# Altium schematic sheet PRUC-Voltmeter_FPGA-Interface.SchDoc: Voltmeter / FPGA XADC
size A4; SheetNumber: 3; SheetTotal: 9
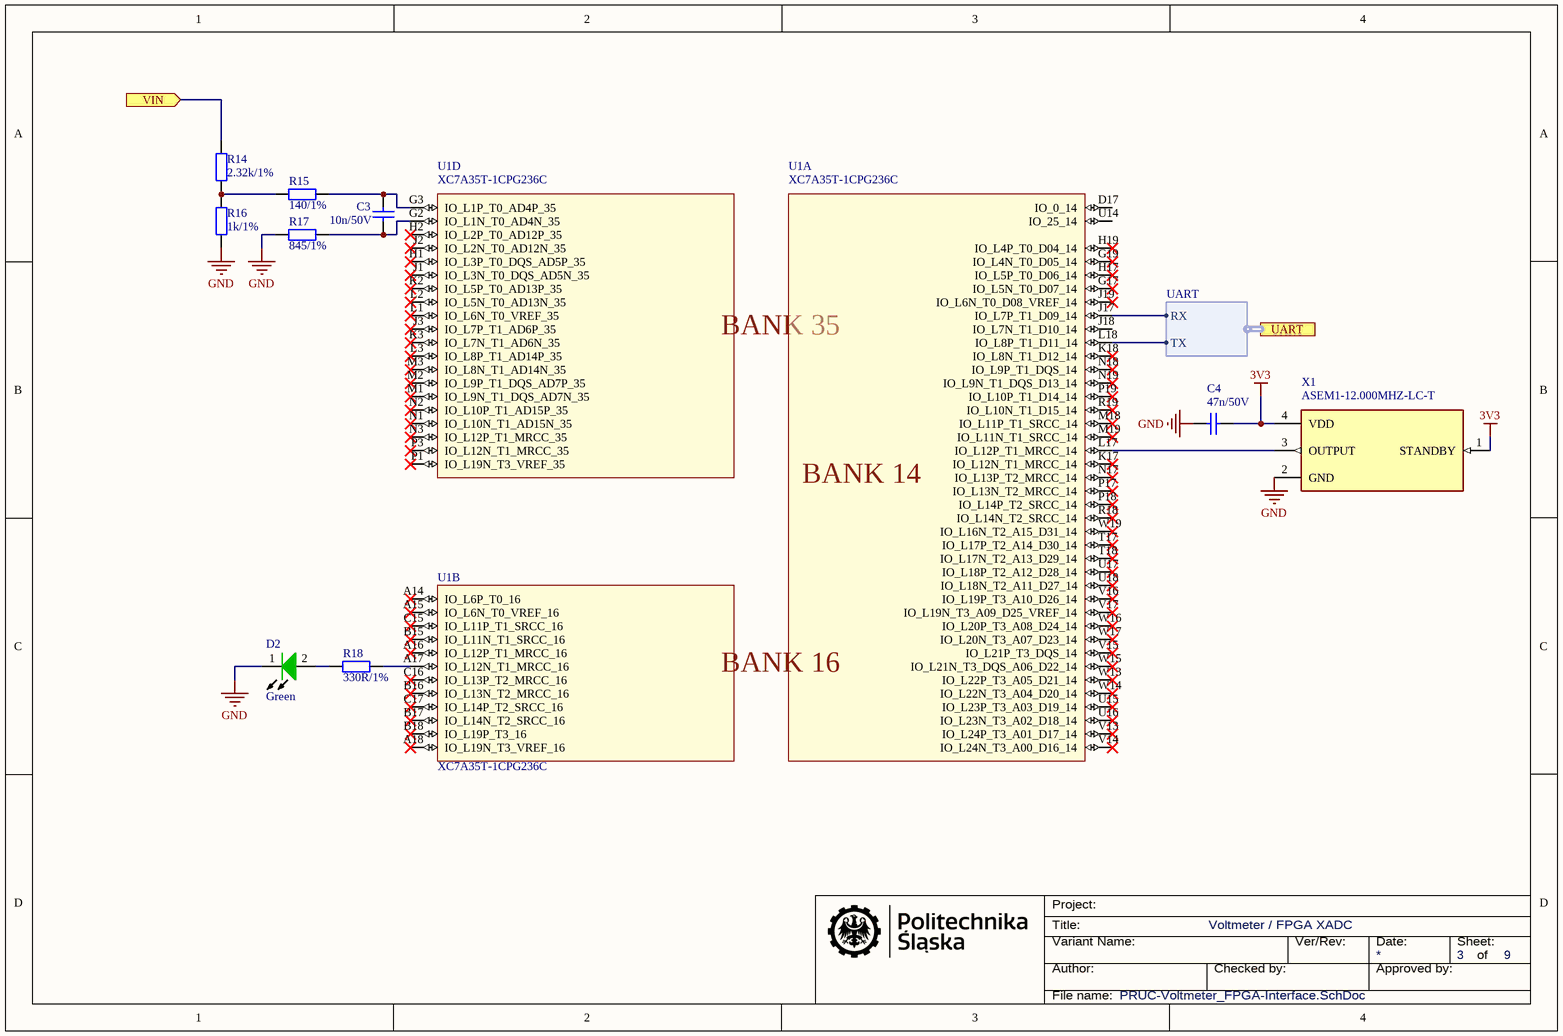
[diagram p0: PRUC-Voltmeter_FPGA-Interface.SchDoc]

## Parts
C3  10n/50V  [MLCC_0603]
C4  47n/50V  [MLCC_0603]
D2  Green  [LED_0805_G]
R14  2.32k/1%  [R_0603]
R15  140/1%  [R_0603]
R16  1k/1%  [R_0603]
R17  845/1%  [R_0603]
R18  330R/1%  [R_0603]
U1  XC7A35T-1CPG236C  [CPG236-0.5mm]  (parts A,B,D of 8)
X1  ASEM1-12.000MHZ-LC-T  [OSC_ASEM1-16.000MHZ-LC-T]

## Ports
UART (harness UART), VIN (in)

## Harnesses
UART: TX, RX

## Nets
3V3: C4.2 X1.1(STANDBY) X1.4(VDD)
GND: C4.1 D2.1(K) R16.2 R17.2 X1.2(GND)
VIN: R14.1 ; port VIN
NetC3_1: C3.1 R15.1 U1.G3(IO_L1P_T0_AD4P_35)
NetC3_2: C3.2 R17.1 U1.G2(IO_L1N_T0_AD4N_35)
NetD2_2: D2.2(A) R18.1
NetR14_2: R14.2 R15.2 R16.1
NetR18_2: R18.2 U1.A17(IO_L12N_T1_MRCC_16)
NetU1_J17: U1.J17(IO_L7P_T1_D09_14) ; port UART.RX
NetU1_L17: U1.L17(IO_L12P_T1_MRCC_14) X1.3(OUTPUT)
NetU1_L18: U1.L18(IO_L8P_T1_D11_14) ; port UART.TX

Not connected (* = marked no-connect by the designer): U1 A14(IO_L6P_T0_16)* A15(IO_L6N_T0_VREF_16)* A16(IO_L12P_T1_MRCC_16)* A18(IO_L19N_T3_VREF_16)* B15(IO_L11N_T1_SRCC_16)* B16(IO_L13N_T2_MRCC_16)* B17(IO_L14N_T2_SRCC_16)* B18(IO_L19P_T3_16)* C15(IO_L11P_T1_SRCC_16)* C16(IO_L13P_T2_MRCC_16)* C17(IO_L14P_T2_SRCC_16)* D17(IO_0_14) G17(IO_L5N_T0_D07_14)* G19(IO_L4N_T0_D05_14)* H1(IO_L3P_T0_DQS_AD5P_35)* H2(IO_L2P_T0_AD12P_35)* H17(IO_L5P_T0_D06_14)* H19(IO_L4P_T0_D04_14)* J1(IO_L3N_T0_DQS_AD5N_35)* J2(IO_L2N_T0_AD12N_35)* J3(IO_L7P_T1_AD6P_35)* J18(IO_L7N_T1_D10_14) J19(IO_L6N_T0_D08_VREF_14)* K2(IO_L5P_T0_AD13P_35)* K3(IO_L7N_T1_AD6N_35)* K17(IO_L12N_T1_MRCC_14)* K18(IO_L8N_T1_D12_14)* L1(IO_L6N_T0_VREF_35)* L2(IO_L5N_T0_AD13N_35)* L3(IO_L8P_T1_AD14P_35)* M1(IO_L9N_T1_DQS_AD7N_35)* M2(IO_L9P_T1_DQS_AD7P_35)* M3(IO_L8N_T1_AD14N_35)* M18(IO_L11P_T1_SRCC_14)* M19(IO_L11N_T1_SRCC_14)* N1(IO_L10N_T1_AD15N_35)* N2(IO_L10P_T1_AD15P_35)* N3(IO_L12P_T1_MRCC_35)* N17(IO_L13P_T2_MRCC_14)* N18(IO_L9P_T1_DQS_14)* N19(IO_L9N_T1_DQS_D13_14)* P1(IO_L19N_T3_VREF_35)* P3(IO_L12N_T1_MRCC_35)* P17(IO_L13N_T2_MRCC_14)* P18(IO_L14P_T2_SRCC_14)* P19(IO_L10P_T1_D14_14)* R18(IO_L14N_T2_SRCC_14)* R19(IO_L10N_T1_D15_14)* T17(IO_L17P_T2_A14_D30_14)* T18(IO_L17N_T2_A13_D29_14)* U14(IO_25_14) U15(IO_L23P_T3_A03_D19_14)* U16(IO_L23N_T3_A02_D18_14)* U17(IO_L18P_T2_A12_D28_14)* U18(IO_L18N_T2_A11_D27_14)* V13(IO_L24P_T3_A01_D17_14)* V14(IO_L24N_T3_A00_D16_14)* V15(IO_L21P_T3_DQS_14)* V16(IO_L19P_T3_A10_D26_14)* V17(IO_L19N_T3_A09_D25_VREF_14)* W13(IO_L22P_T3_A05_D21_14)* W14(IO_L22N_T3_A04_D20_14)* W15(IO_L21N_T3_DQS_A06_D22_14)* W16(IO_L20P_T3_A08_D24_14)* W17(IO_L20N_T3_A07_D23_14)* W19(IO_L16N_T2_A15_D31_14)*

## Notes on the sheet
- Project:
- Title:
- Variant Name:
- Author:
- Checked by:
- Ver/Rev:
- Date:
- Approved by:
- Sheet:
- of
- File name:
- (in symbol XC7A35T-1CPG236C, part A) BANK 14
- (in symbol XC7A35T-1CPG236C, part B) BANK 16
- (in symbol XC7A35T-1CPG236C, part D) BANK 35

## Library data of the parts
C3 = CL10B103KB8NNNC: Manufacturer: Samsung; Part Description: 0603 General Multilayer Ceramic Capacitor; Index: 29; Part Number: CL10B103KB8NNNC; Value: 10n/50V; SMD: true; Manufacturer Part Number: CL10B103KB8NNNC; Supplier 1: TME; Supplier Part Number 1: CL10B103KB8NNNC; HelpURL: https://www.tme.eu/pl/Document/7da762c1dbaf553c64ad9c40d3603826/mlcc_samsung.pdf; Category: Capacitors
C4 = CL10B473KB8NNNC: Manufacturer: Samsung; Part Description: 0603 General Multilayer Ceramic Capacitor; Index: 160; Part Number: CL10B473KB8NNNC; Value: 47n/50V; SMD: true; Manufacturer Part Number: CL10B473KB8NNNC; Supplier 1: TME; Supplier Part Number 1: CL10B473KB8NNNC; HelpURL: https://www.tme.eu/Document/4a42202b32dab16128fe107dd69598cc/samsung-chip-cap.pdf; Category: Capacitors
D2 = OSG50805C1E: Manufacturer: OptoSupply; Part Description: 0805 Chip LED Green; Index: 26; Part Number: OSG50805C1E; Value: Green; SMD: true; Manufacturer Part Number: OSG50805C1E; Supplier 1: TME; Supplier Part Number 1: OSG50805C1E; HelpURL: https://www.tme.eu/pl/Document/6f99baddc8b38eb1a865ea6b78250b2b/OSXX0805C1E-DTE.pdf; Category: Diodes
R14 R15 R17 = 0603SAF2201T5E: Manufacturer: Royalohm; Part Description: 0603 Thick Film Chip Resistor; Index: 15; Value: 2.2k/1%; Part Number: 0603SAF2201T5E; SMD: true; Manufacturer Part Number: 0603SAF2201T5E; Supplier 1: TME; Supplier Part Number 1: SMD0603-2K2-1%; HelpURL: https://www.tme.eu/pl/Document/b315665a56acbc42df513c99b390ad98/ROYALOHM-THICKFILM.pdf; Category: Resistors
R16 = 0603SAF1001T5E: Manufacturer: Royalohm; Part Description: 0603 Thick Film Chip Resistor; Index: 7; Part Number: 0603SAF1001T5E; Value: 1k/1%; SMD: true; Manufacturer Part Number: 0603SAF1001T5E; Supplier 1: TME; Supplier Part Number 1: SMD0603-1K-1%; HelpURL: https://www.tme.eu/pl/Document/b315665a56acbc42df513c99b390ad98/ROYALOHM-THICKFILM.pdf; Category: Resistors
R18 = 0603SAF3300T5E: Manufacturer: Royalohm; Part Description: 0603 Thick Film Chip Resistor; Index: 119; Part Number: 0603SAF3300T5E; Value: 330R/1%; SMD: true; Manufacturer Part Number: 0603SAF3300T5E; Supplier 1: TME; Supplier Part Number 1: SMD0603-330R-1%; HelpURL: https://www.tme.eu/pl/Document/b315665a56acbc42df513c99b390ad98/ROYALOHM-THICKFILM.pdf; Category: Resistors
U1 = XC7A35T-1CPG236C: Manufacturer: Xilinx; Part Description: Xilinx 7 Series FPGA; Index: 159; Value: 33280 Cells; Part Number: XC7A35T-1CPG236C; SMD: true; Manufacturer Part Number: XC7A35T-1CPG236C; Supplier 1: Mouser; Supplier Part Number 1: 217-XC7A35T-1CPG236C; HelpURL: https://pl.mouser.com/datasheet/2/903/ds180_7Series_Overview-1591537.pdf; Category: FPGA
X1 = ASEM1-16.000MHZ-LC-T: 16MHz XO _Standard_ CMOS Oscillator 3.3V Standby _Power Down_ 4-SMD, No Lead; MF: Abracon LLC; Package: SMD-4 Abracon LLC; Price: None; SnapEDA_Link: https://www.snapeda.com/parts/ASEM1-16.000MHZ-LC-T/Abracon%20LLC/view-part/230242/?ref=snap; Availability: Unavailable; Value: *; MP: ASEM1-16.000MHZ-LC-T